# EAGLE design matam_qfn20 (EAGLE 6.5.0)
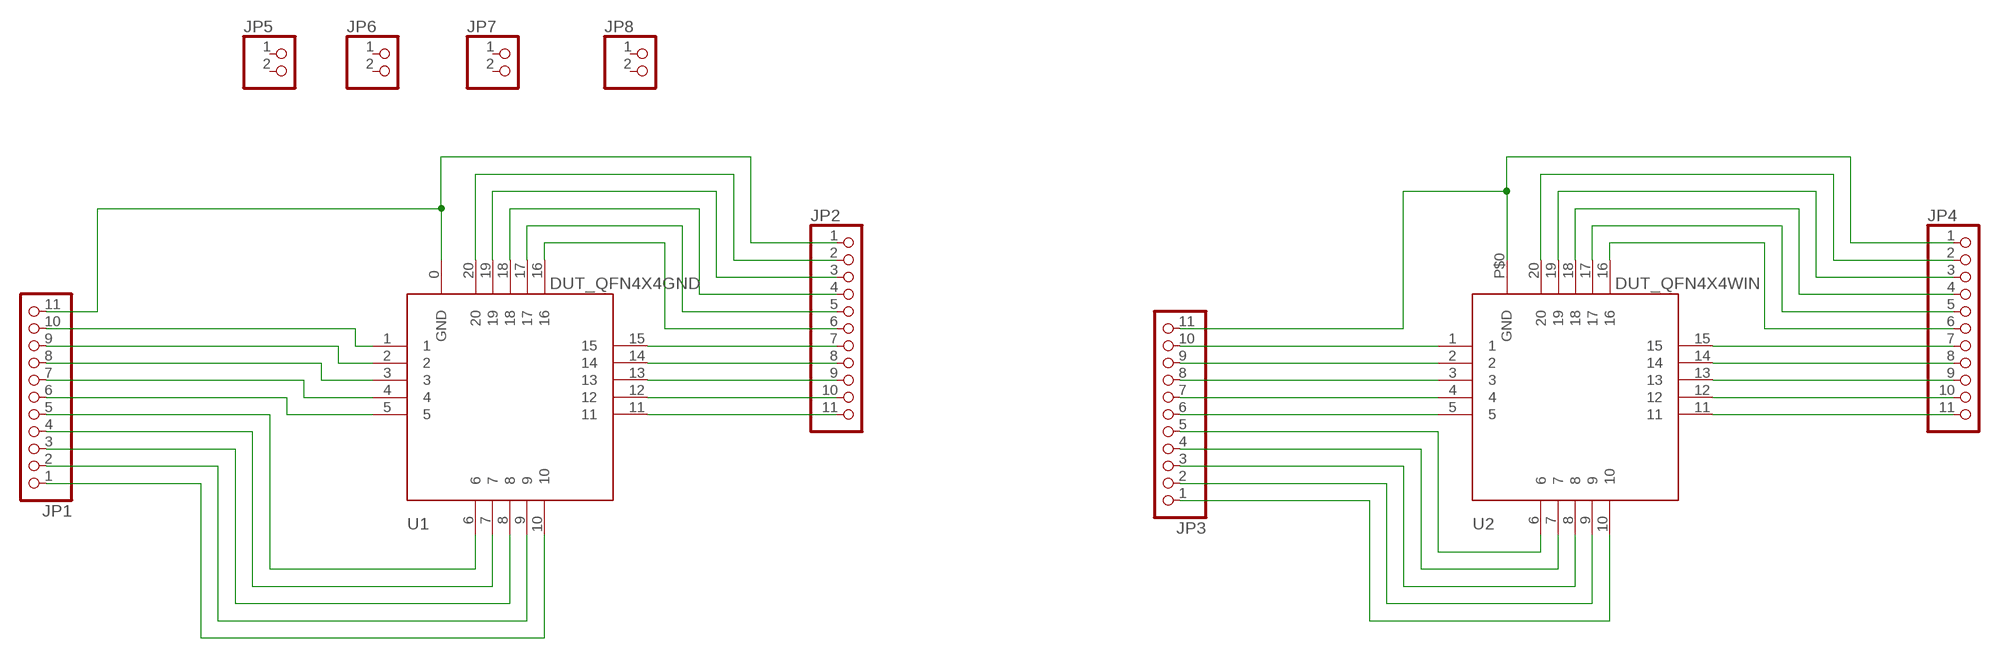
[diagram p0: schematic, sheet 1]

## Parts
JP1  PINHD-1X11  [1X11]
JP2  PINHD-1X11  [1X11]
JP3  PINHD-1X11  [1X11]
JP4  PINHD-1X11  [1X11]
JP5  PINHD-1X2/90  [1X02/90]
JP6  PINHD-1X2/90  [1X02/90]
JP7  PINHD-1X2/90  [1X02/90]
JP8  PINHD-1X2/90  [1X02/90]
U1  DUT_QFN4X4GND  [QFN20_4X4_GND]
U2  DUT_QFN4X4WIN  [QFN20_4X4_WINDOW]

## Nets
N$1 [gnd]: JP1.11 JP2.1 U1.0(GND)
N$2: JP1.10 U1.1
N$3: JP1.9 U1.2
N$4: JP1.8 U1.3
N$5: JP1.7 U1.4
N$6: JP1.6 U1.5
N$7: JP1.5 U1.6
N$8: JP1.4 U1.7
N$9: JP1.3 U1.8
N$10: JP1.2 U1.9
N$11: JP1.1 U1.10
N$12: JP2.11 U1.11
N$13: JP2.10 U1.12
N$14: JP2.9 U1.13
N$15: JP2.8 U1.14
N$16: JP2.7 U1.15
N$17: JP2.6 U1.16
N$18: JP2.5 U1.17
N$19: JP2.4 U1.18
N$20: JP2.3 U1.19
N$21: JP2.2 U1.20
N$22: JP3.10 U2.1
N$23: JP3.9 U2.2
N$24: JP3.8 U2.3
N$25: JP3.7 U2.4
N$26: JP3.6 U2.5
N$27: JP3.5 U2.6
N$28: JP3.4 U2.7
N$29: JP3.3 U2.8
N$30: JP3.2 U2.9
N$31: JP3.1 U2.10
N$32 [gnd]: JP3.11 JP4.1 U2.P$0(GND)
N$33: JP4.11 U2.11
N$34: JP4.10 U2.12
N$35: JP4.9 U2.13
N$36: JP4.8 U2.14
N$37: JP4.7 U2.15
N$38: JP4.6 U2.16
N$39: JP4.5 U2.17
N$40: JP4.4 U2.18
N$41: JP4.3 U2.19
N$42: JP4.2 U2.20
Unconnected: JP5.1 JP5.2 JP6.1 JP6.2 JP7.1 JP7.2 JP8.1 JP8.2

## Library data of the parts
JP1-JP4 = pinhead:PINHD-1X11: PIN HEADER
JP5-JP8 = pinhead:PINHD-1X2: PIN HEADER
U1 U2 = qfn20:DUT_QFN4X4

## Net classes
1 gnd: clearance 0.406 mm

## Board
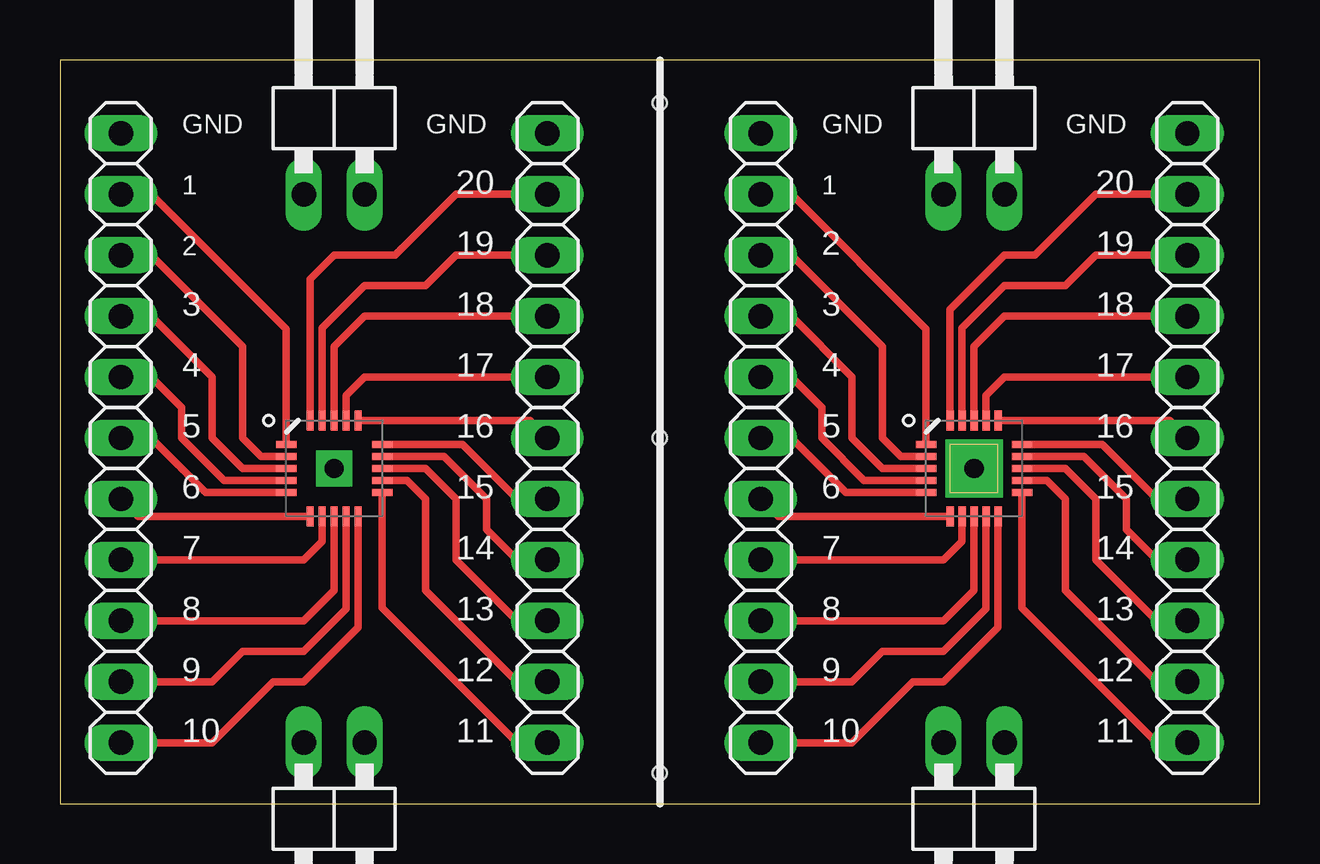
[diagram p1: board, top side]
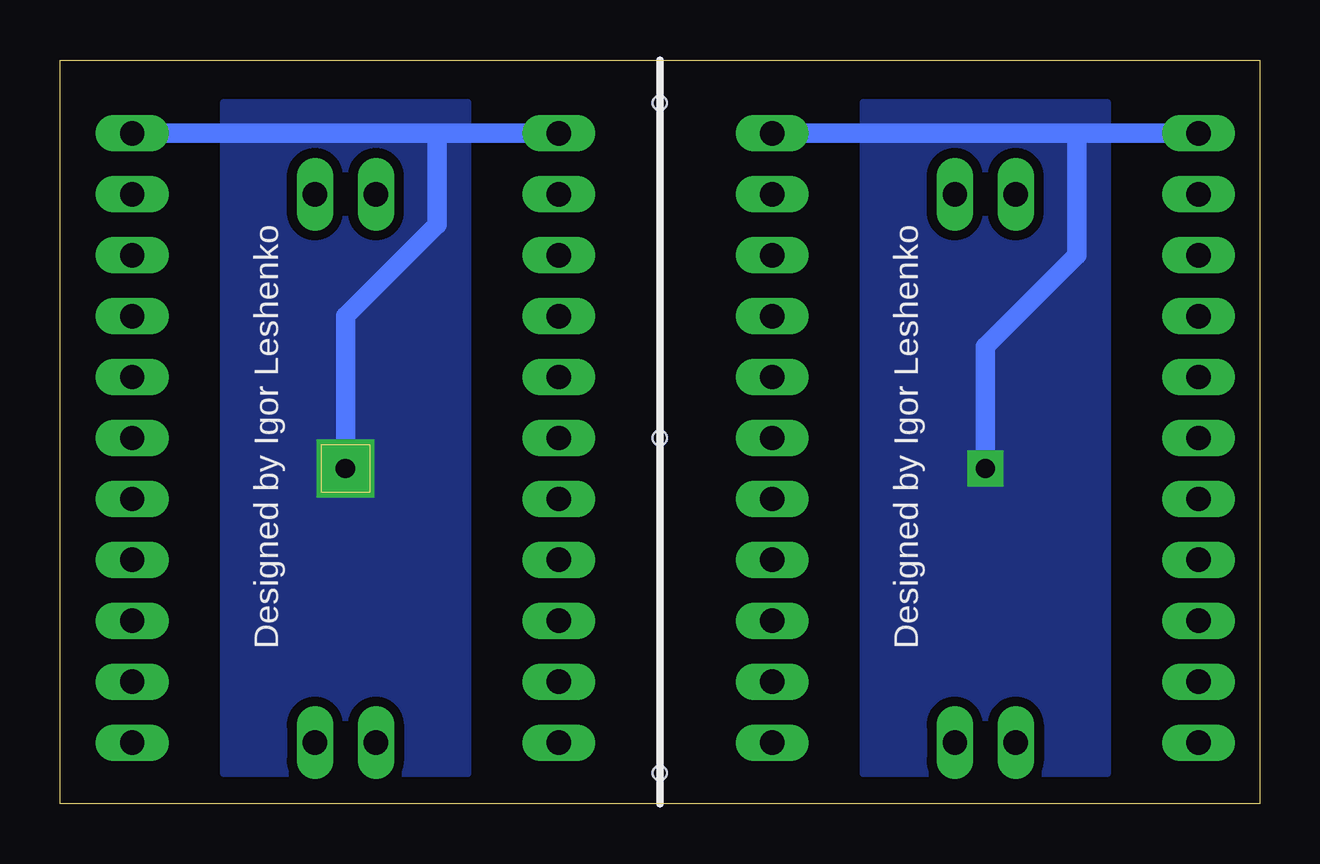
[diagram p2: board, bottom side, seen from below]

Size 50 x 31 mm. Coordinates in mm from the lower left corner, seen from the top.
Outline: 0,0 50,0 50,31 0,31 0,0
Copper layers (1*16): Top 0.035mm / dielectric 1.5mm / Bottom 0.035mm
Design rules "Fusion_eagle_rule_v1.1": minimum track width 6mil, minimum drill 12mil, track to track 6mil, track to pad 6mil, pad to pad 6mil, via to via 6mil, smd to smd 0mil, copper to edge 10mil, drill to drill 10mil, minimum pad ring 10mil, minimum via ring 6mil, stop-mask expansion 2mil, vias tented up to drill 100mil, thermal gap 10mil
Holes 0.6 mm at 25,29.21 25,15.24 25,1.27

### Footprints (pad centres in the part's own frame; a part is rotated, then mirrored left to right if it is on the bottom)
1X11 = drill 1.016 long: 1 -12.7,0; 2 -10.16,0; 3 -7.62,0; 4 -5.08,0; 5 -2.54,0; 6 0,0; 7 2.54,0; 8 5.08,0; 9 7.62,0; 10 10.16,0; 11 12.7,0
1X02/90 = drill 1.016 long: 1 -1.27,-3.81; 2 1.27,-3.81
QFN20_4X4_GND = drill 0.8 pad 1.5 square: 0 0,0 | smd 0.85 x 0.3: 1 -2,1; 2 -2,0.5; 3 -2,0; 4 -2,-0.5; 5 -2,-1; 11 2,-1; 12 2,-0.5; 13 2,0; 14 2,0.5; 15 2,1 | smd 0.3 x 0.85: 6 -1,-2; 7 -0.5,-2; 8 0,-2; 9 0.5,-2; 10 1,-2; 16 1,2; 17 0.5,2; 18 0,2; 19 -0.5,2; 20 -1,2
QFN20_4X4_WINDOW = smd 0.85 x 0.3: 1 -2,1; 2 -2,0.5; 3 -2,0; 4 -2,-0.5; 5 -2,-1; 11 2,-1; 12 2,-0.5; 13 2,0; 14 2,0.5; 15 2,1 | smd 0.3 x 0.85: 6 -1,-2; 7 -0.5,-2; 8 0,-2; 9 0.5,-2; 10 1,-2; 16 1,2; 17 0.5,2; 18 0,2; 19 -0.5,2; 20 -1,2 | drill 0.8 pad 2.4 square: P$0 0,0

### Placement (x,y rotation side)
JP1  2.54,15.24 90 top
JP2  20.32,15.24 270 top
JP3  29.21,15.24 90 top
JP4  46.99,15.24 270 top
JP5  11.43,29.21 0 top
JP6  11.43,-1.27 180 top
JP7  38.1,29.21 0 top
JP8  38.1,-1.27 180 top
U1  11.43,13.97 0 top
U2  38.1,13.97 0 top

### Tracks (layer width: path | path; a pad name or v marks a point on that pad's centre or on a via)
N$1
  Bottom 0.813: JP1.11 7.62,27.94 | 7.62,27.94 JP2.1 | U1.0 11.43,19.05 7.62,22.86 7.62,27.94
  pour Bottom: 6.35,29.21 6.35,1.27 16.51,1.27 16.51,29.21
N$2
  Top 0.305: U1.1 9.43,19.78 3.81,25.4 JP1.10
N$3
  Top 0.305: U1.2 8.39,14.47 7.62,15.24 7.62,19.05 3.81,22.86 JP1.9
N$4
  Top 0.305: U1.3 7.62,13.97 6.35,15.24 6.35,17.78 3.81,20.32 JP1.8
N$5
  Top 0.305: U1.4 6.85,13.47 5.08,15.24 5.08,16.51 3.81,17.78 JP1.7
N$6
  Top 0.305: U1.5 6.08,12.97 3.81,15.24 JP1.6
N$7
  Top 0.305: U1.6 3.27,11.97 JP1.5
N$8
  Top 0.305: U1.7 10.93,10.93 10.16,10.16 JP1.4
N$9
  Top 0.305: U1.8 11.43,8.89 10.16,7.62 JP1.3
N$10
  Top 0.305: U1.9 11.93,8.12 10.16,6.35 7.62,6.35 6.35,5.08 JP1.2
N$11
  Top 0.305: JP1.1 6.35,2.54 8.89,5.08 10.16,5.08 12.43,7.35 U1.10
N$12
  Top 0.305: U1.11 13.43,8.16 19.05,2.54 JP2.11
N$13
  Top 0.305: U1.12 14.47,13.47 15.24,12.7 15.24,8.89 19.05,5.08 JP2.10
N$14
  Top 0.305: U1.13 15.24,13.97 16.51,12.7 16.51,10.16 19.05,7.62 JP2.9
N$15
  Top 0.305: U1.14 16.01,14.47 17.78,12.7 17.78,11.43 19.05,10.16 JP2.8
N$16
  Top 0.305: U1.15 16.78,14.97 19.05,12.7 JP2.7
N$17
  Top 0.305: U1.16 19.59,15.97 JP2.6
N$18
  Top 0.305: U1.17 11.93,17.01 12.7,17.78 JP2.5
N$19
  Top 0.305: U1.18 11.43,19.05 12.7,20.32 JP2.4
N$20
  Top 0.305: U1.19 10.93,19.82 12.7,21.59 15.24,21.59 16.51,22.86 JP2.3
N$21
  Top 0.305: U1.20 10.43,21.86 11.43,22.86 13.97,22.86 16.51,25.4 JP2.2
N$22
  Top 0.305: U2.1 36.1,19.78 30.48,25.4 JP3.10
N$23
  Top 0.305: U2.2 35.06,14.47 34.29,15.24 34.29,19.05 30.48,22.86 JP3.9
N$24
  Top 0.305: U2.3 34.29,13.97 33.02,15.24 33.02,17.78 30.48,20.32 JP3.8
N$25
  Top 0.305: U2.4 33.52,13.47 31.75,15.24 31.75,16.51 30.48,17.78 JP3.7
N$26
  Top 0.305: U2.5 32.75,12.97 30.48,15.24 JP3.6
N$27
  Top 0.305: U2.6 29.94,11.97 JP3.5
N$28
  Top 0.305: U2.7 37.6,10.93 36.83,10.16 JP3.4
N$29
  Top 0.305: U2.8 38.1,8.89 36.83,7.62 JP3.3
N$30
  Top 0.305: U2.9 38.6,8.12 36.83,6.35 34.29,6.35 33.02,5.08 JP3.2
N$31
  Top 0.305: U2.10 39.1,7.35 36.83,5.08 35.56,5.08 33.02,2.54 JP3.1
N$32
  Bottom 0.813: JP3.11 34.29,27.94 | 34.29,27.94 JP4.1 | U2.P$0 38.1,20.32 34.29,24.13 34.29,27.94
  pour Bottom: 33.02,29.21 43.18,29.21 43.18,1.27 33.02,1.27
N$33
  Top 0.305: U2.11 40.1,8.16 45.72,2.54 JP4.11
N$34
  Top 0.305: U2.12 41.14,13.47 41.91,12.7 41.91,8.89 45.72,5.08 JP4.10
N$35
  Top 0.305: U2.13 41.91,13.97 43.18,12.7 43.18,10.16 45.72,7.62 JP4.9
N$36
  Top 0.305: U2.14 42.68,14.47 44.45,12.7 44.45,11.43 45.72,10.16 JP4.8
N$37
  Top 0.305: U2.15 43.45,14.97 45.72,12.7 JP4.7
N$38
  Top 0.305: U2.16 46.26,15.97 JP4.6
N$39
  Top 0.305: U2.17 38.6,17.01 39.37,17.78 JP4.5
N$40
  Top 0.305: U2.18 38.1,19.05 39.37,20.32 JP4.4
N$41
  Top 0.305: U2.19 37.6,19.82 39.37,21.59 41.91,21.59 43.18,22.86 JP4.3
N$42
  Top 0.305: JP4.2 43.18,25.4 40.64,22.86 39.37,22.86 37.1,20.59 U2.20

### Text on the board
tNames: GND | GND | GND | GND | 1 | 20 | 1 | 20 | 2 | 19 | 2 | 19 | 3 | 18 | 3 | 18 | 4 | 17 | 4 | 17 | 5 | 16 | 5 | 16 | 6 | 15 | 6 | 15 | 7 | 14 | 7 | 14 | 8 | 13 | 8 | 13 | 9 | 12 | 9 | 12 | 10 | 11 | 10 | 11
bNames: Designed by Igor Leshenko | Designed by Igor Leshenko